# Altium schematic sheet Sheet2.SchDoc
size A2
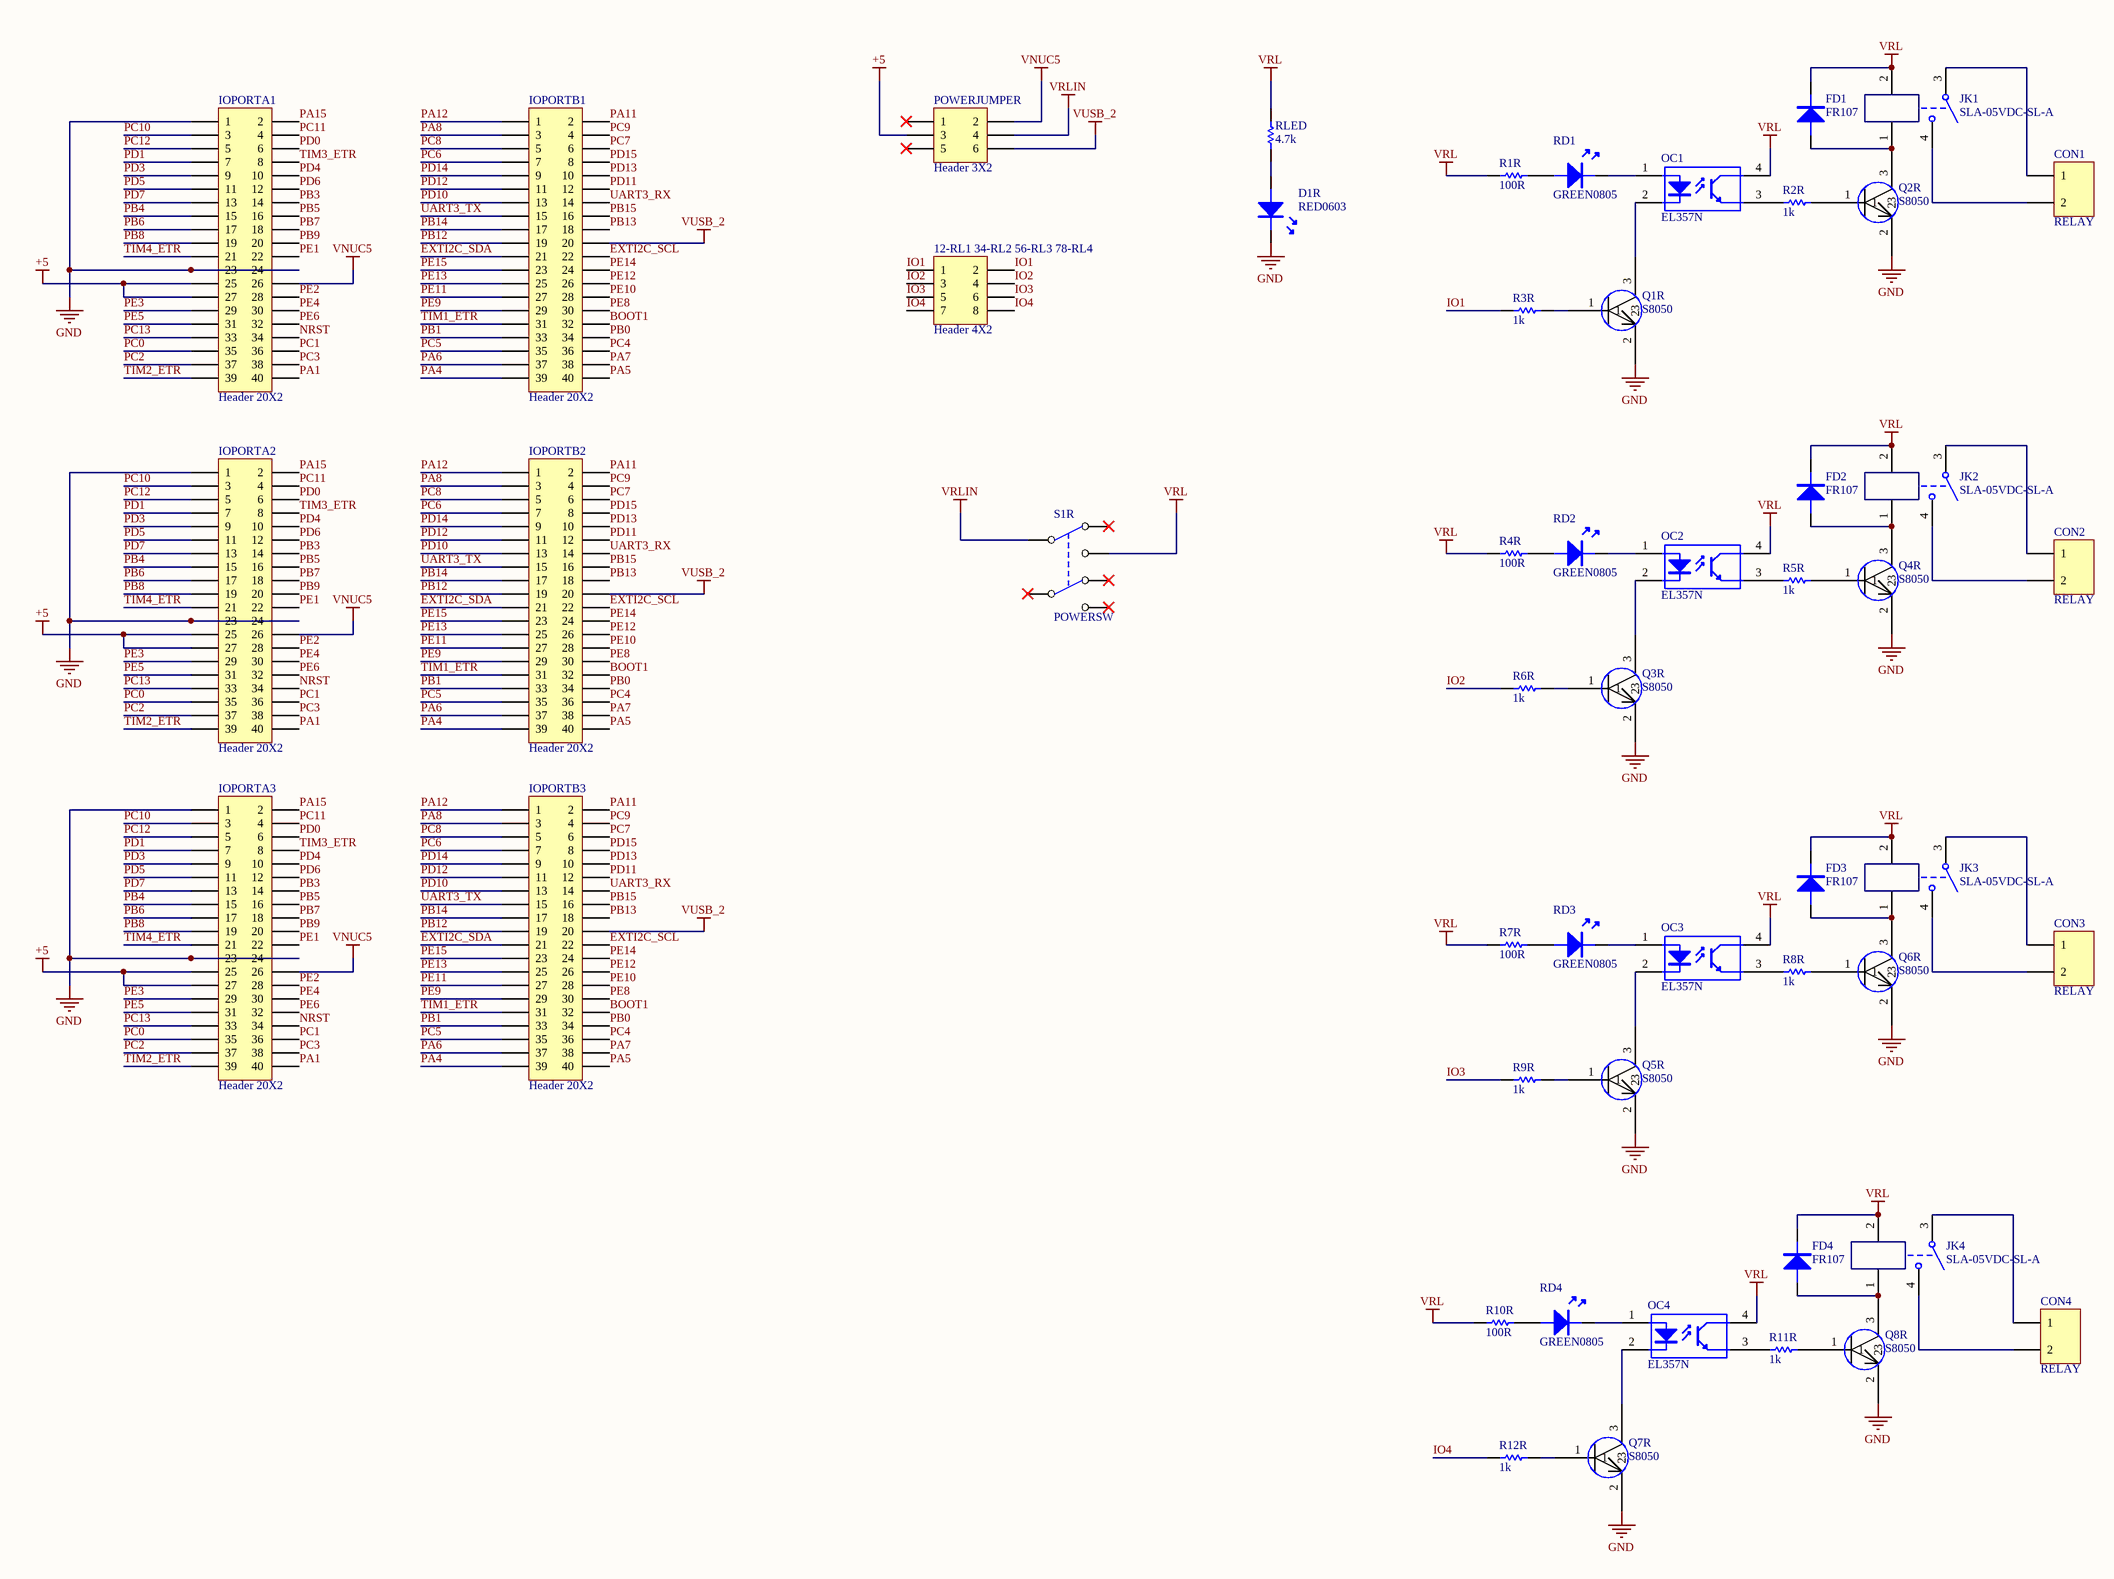
[diagram p0: Sheet2.SchDoc]

## Parts
12-RL1_34-RL2_56-RL3_78-RL4  Header 4X2  [HDR2X4]
CON1  RELAY  [KF301-2P]
CON2  RELAY  [KF301-2P]
CON3  RELAY  [KF301-2P]
CON4  RELAY  [KF301-2P]
D1R  RED0603  [LED-0603W]
FD1  FR107  [SOD-123]
FD2  FR107  [SOD-123]
FD3  FR107  [SOD-123]
FD4  FR107  [SOD-123]
IOPORTA1  Header 20X2  [HDR2X20]
IOPORTA2  Header 20X2  [HDR2X20]
IOPORTA3  Header 20X2  [HDR2X20]
IOPORTB1  Header 20X2  [HDR2X20]
IOPORTB2  Header 20X2  [HDR2X20]
IOPORTB3  Header 20X2  [HDR2X20]
JK1  SLA-05VDC-SL-A  [SLA-xxVDC-SL-A]
JK2  SLA-05VDC-SL-A  [SLA-xxVDC-SL-A]
JK3  SLA-05VDC-SL-A  [SLA-xxVDC-SL-A]
JK4  SLA-05VDC-SL-A  [SLA-xxVDC-SL-A]
OC1  EL357N  [SMD_EL357N]
OC2  EL357N  [SMD_EL357N]
OC3  EL357N  [SMD_EL357N]
OC4  EL357N  [SMD_EL357N]
POWERJUMPER  Header 3X2  [HDR2X3]
Q1R  S8050  [SOT23]
Q2R  S8050  [SOT23]
Q3R  S8050  [SOT23]
Q4R  S8050  [SOT23]
Q5R  S8050  [SOT23]
Q6R  S8050  [SOT23]
Q7R  S8050  [SOT23]
Q8R  S8050  [SOT23]
R1R  100R  [0603R]
R2R  1k  [0603R]
R3R  1k  [0603R]
R4R  100R  [0603R]
R5R  1k  [0603R]
R6R  1k  [0603R]
R7R  100R  [0603R]
R8R  1k  [0603R]
R9R  1k  [0603R]
R10R  100R  [0603R]
R11R  1k  [0603R]
R12R  1k  [0603R]
RD1  GREEN0805  [LED-0805G]
RD2  GREEN0805  [LED-0805G]
RD3  GREEN0805  [LED-0805G]
RD4  GREEN0805  [LED-0805G]
RLED  4.7k  [0603R]
S1R  POWERSW  [KFT DIP-7X7]

## Nets
+5: IOPORTA1.25 IOPORTA1.27 IOPORTA2.25 IOPORTA2.27 IOPORTA3.25 IOPORTA3.27 POWERJUMPER.3
GND: D1R.K IOPORTA1.1 IOPORTA1.23 IOPORTA1.24 IOPORTA2.1 IOPORTA2.23 IOPORTA2.24 IOPORTA3.1 IOPORTA3.23 IOPORTA3.24 Q1R.2 Q2R.2 Q3R.2 Q4R.2 Q5R.2 Q6R.2 Q7R.2 Q8R.2
VNUC5: IOPORTA1.26 IOPORTA2.26 IOPORTA3.26 POWERJUMPER.2
VRL: FD1.K FD2.K FD3.K FD4.K JK1.2 JK2.2 JK3.2 JK4.2 OC1.4(C) OC2.4(C) OC3.4(C) OC4.4(C) R1R.1 R4R.1 R7R.1 R10R.1 RLED.2 S1R.1
VRLIN: POWERJUMPER.4 S1R.2
VUSB_2: IOPORTB1.20 IOPORTB2.20 IOPORTB3.20 POWERJUMPER.6
BOOT1: IOPORTB1.32 IOPORTB2.32 IOPORTB3.32
EXTI2C_SCL: IOPORTB1.22 IOPORTB2.22 IOPORTB3.22
EXTI2C_SDA: IOPORTB1.21 IOPORTB2.21 IOPORTB3.21
IO1: 12-RL1_34-RL2_56-RL3_78-RL4.1 12-RL1_34-RL2_56-RL3_78-RL4.2 R3R.1
IO2: 12-RL1_34-RL2_56-RL3_78-RL4.3 12-RL1_34-RL2_56-RL3_78-RL4.4 R6R.1
IO3: 12-RL1_34-RL2_56-RL3_78-RL4.5 12-RL1_34-RL2_56-RL3_78-RL4.6 R9R.1
IO4: 12-RL1_34-RL2_56-RL3_78-RL4.7 12-RL1_34-RL2_56-RL3_78-RL4.8 R12R.1
NRST: IOPORTA1.34 IOPORTA2.34 IOPORTA3.34
PA1: IOPORTA1.40 IOPORTA2.40 IOPORTA3.40
PA4: IOPORTB1.39 IOPORTB2.39 IOPORTB3.39
PA5: IOPORTB1.40 IOPORTB2.40 IOPORTB3.40
PA6: IOPORTB1.37 IOPORTB2.37 IOPORTB3.37
PA7: IOPORTB1.38 IOPORTB2.38 IOPORTB3.38
PA8: IOPORTB1.3 IOPORTB2.3 IOPORTB3.3
PA11: IOPORTB1.2 IOPORTB2.2 IOPORTB3.2
PA12: IOPORTB1.1 IOPORTB2.1 IOPORTB3.1
PA15: IOPORTA1.2 IOPORTA2.2 IOPORTA3.2
PB0: IOPORTB1.34 IOPORTB2.34 IOPORTB3.34
PB1: IOPORTB1.33 IOPORTB2.33 IOPORTB3.33
PB3: IOPORTA1.14 IOPORTA2.14 IOPORTA3.14
PB4: IOPORTA1.15 IOPORTA2.15 IOPORTA3.15
PB5: IOPORTA1.16 IOPORTA2.16 IOPORTA3.16
PB6: IOPORTA1.17 IOPORTA2.17 IOPORTA3.17
PB7: IOPORTA1.18 IOPORTA2.18 IOPORTA3.18
PB8: IOPORTA1.19 IOPORTA2.19 IOPORTA3.19
PB9: IOPORTA1.20 IOPORTA2.20 IOPORTA3.20
PB12: IOPORTB1.19 IOPORTB2.19 IOPORTB3.19
PB13: IOPORTB1.18 IOPORTB2.18 IOPORTB3.18
PB14: IOPORTB1.17 IOPORTB2.17 IOPORTB3.17
PB15: IOPORTB1.16 IOPORTB2.16 IOPORTB3.16
PC0: IOPORTA1.35 IOPORTA2.35 IOPORTA3.35
PC1: IOPORTA1.36 IOPORTA2.36 IOPORTA3.36
PC2: IOPORTA1.37 IOPORTA2.37 IOPORTA3.37
PC3: IOPORTA1.38 IOPORTA2.38 IOPORTA3.38
PC4: IOPORTB1.36 IOPORTB2.36 IOPORTB3.36
PC5: IOPORTB1.35 IOPORTB2.35 IOPORTB3.35
PC6: IOPORTB1.7 IOPORTB2.7 IOPORTB3.7
PC7: IOPORTB1.6 IOPORTB2.6 IOPORTB3.6
PC8: IOPORTB1.5 IOPORTB2.5 IOPORTB3.5
PC9: IOPORTB1.4 IOPORTB2.4 IOPORTB3.4
PC10: IOPORTA1.3 IOPORTA2.3 IOPORTA3.3
PC11: IOPORTA1.4 IOPORTA2.4 IOPORTA3.4
PC12: IOPORTA1.5 IOPORTA2.5 IOPORTA3.5
PC13: IOPORTA1.33 IOPORTA2.33 IOPORTA3.33
PD0: IOPORTA1.6 IOPORTA2.6 IOPORTA3.6
PD1: IOPORTA1.7 IOPORTA2.7 IOPORTA3.7
PD3: IOPORTA1.9 IOPORTA2.9 IOPORTA3.9
PD4: IOPORTA1.10 IOPORTA2.10 IOPORTA3.10
PD5: IOPORTA1.11 IOPORTA2.11 IOPORTA3.11
PD6: IOPORTA1.12 IOPORTA2.12 IOPORTA3.12
PD7: IOPORTA1.13 IOPORTA2.13 IOPORTA3.13
PD10: IOPORTB1.13 IOPORTB2.13 IOPORTB3.13
PD11: IOPORTB1.12 IOPORTB2.12 IOPORTB3.12
PD12: IOPORTB1.11 IOPORTB2.11 IOPORTB3.11
PD13: IOPORTB1.10 IOPORTB2.10 IOPORTB3.10
PD14: IOPORTB1.9 IOPORTB2.9 IOPORTB3.9
PD15: IOPORTB1.8 IOPORTB2.8 IOPORTB3.8
PE1: IOPORTA1.22 IOPORTA2.22 IOPORTA3.22
PE2: IOPORTA1.28 IOPORTA2.28 IOPORTA3.28
PE3: IOPORTA1.29 IOPORTA2.29 IOPORTA3.29
PE4: IOPORTA1.30 IOPORTA2.30 IOPORTA3.30
PE5: IOPORTA1.31 IOPORTA2.31 IOPORTA3.31
PE6: IOPORTA1.32 IOPORTA2.32 IOPORTA3.32
PE8: IOPORTB1.30 IOPORTB2.30 IOPORTB3.30
PE9: IOPORTB1.29 IOPORTB2.29 IOPORTB3.29
PE10: IOPORTB1.28 IOPORTB2.28 IOPORTB3.28
PE11: IOPORTB1.27 IOPORTB2.27 IOPORTB3.27
PE12: IOPORTB1.26 IOPORTB2.26 IOPORTB3.26
PE13: IOPORTB1.25 IOPORTB2.25 IOPORTB3.25
PE14: IOPORTB1.24 IOPORTB2.24 IOPORTB3.24
PE15: IOPORTB1.23 IOPORTB2.23 IOPORTB3.23
TIM1_ETR: IOPORTB1.31 IOPORTB2.31 IOPORTB3.31
TIM2_ETR: IOPORTA1.39 IOPORTA2.39 IOPORTA3.39
TIM3_ETR: IOPORTA1.8 IOPORTA2.8 IOPORTA3.8
TIM4_ETR: IOPORTA1.21 IOPORTA2.21 IOPORTA3.21
UART3_RX: IOPORTB1.14 IOPORTB2.14 IOPORTB3.14
UART3_TX: IOPORTB1.15 IOPORTB2.15 IOPORTB3.15
NetCON1_1: CON1.1 JK1.3
NetCON1_2: CON1.2 JK1.4
NetCON2_1: CON2.1 JK2.3
NetCON2_2: CON2.2 JK2.4
NetCON3_1: CON3.1 JK3.3
NetCON3_2: CON3.2 JK3.4
NetCON4_1: CON4.1 JK4.3
NetCON4_2: CON4.2 JK4.4
NetD1R_A: D1R.A RLED.1
NetFD1_A: FD1.A JK1.1 Q2R.3
NetFD2_A: FD2.A JK2.1 Q4R.3
NetFD3_A: FD3.A JK3.1 Q6R.3
NetFD4_A: FD4.A JK4.1 Q8R.3
NetOC1_1: OC1.1(A) RD1.K
NetOC1_2: OC1.2(K) Q1R.3
NetOC1_3: OC1.3(E) R2R.1
NetOC2_1: OC2.1(A) RD2.K
NetOC2_2: OC2.2(K) Q3R.3
NetOC2_3: OC2.3(E) R5R.1
NetOC3_1: OC3.1(A) RD3.K
NetOC3_2: OC3.2(K) Q5R.3
NetOC3_3: OC3.3(E) R8R.1
NetOC4_1: OC4.1(A) RD4.K
NetOC4_2: OC4.2(K) Q7R.3
NetOC4_3: OC4.3(E) R11R.1
NetQ1R_1: Q1R.1 R3R.2
NetQ2R_1: Q2R.1 R2R.2
NetQ3R_1: Q3R.1 R6R.2
NetQ4R_1: Q4R.1 R5R.2
NetQ5R_1: Q5R.1 R9R.2
NetQ6R_1: Q6R.1 R8R.2
NetQ7R_1: Q7R.1 R12R.2
NetQ8R_1: Q8R.1 R11R.2
NetR1R_2: R1R.2 RD1.A
NetR4R_2: R4R.2 RD2.A
NetR7R_2: R7R.2 RD3.A
NetR10R_2: R10R.2 RD4.A

Not connected (* = marked no-connect by the designer): POWERJUMPER 1* 5*; S1R 3* 4* 5* 6*

## Library data of the parts
12-RL1_34-RL2_56-RL3_78-RL4 = Header 4X2: Header, 4-Pin, Dual row; LatestRevisionDate: 17-Jul-2002; LatestRevisionNote: Re-released for DXP Platform.; Publisher: Altium Limited
CON1-CON4 = Connector-2P
D1R RD1-RD4 = LED
FD1-FD4 = DIODE: 普通二极管
IOPORTA1-IOPORTA3 IOPORTB1-IOPORTB3 = Header 20X2: Header, 20-Pin, Dual row; LatestRevisionDate: 17-Jul-2002; LatestRevisionNote: Re-released for DXP Platform.; Publisher: Altium Limited
JK1-JK4 = SLA-05VDC-SL-A: 5V常开
OC1-OC4 = EL357N: 线性光耦
POWERJUMPER = Header 3X2: Header, 3-Pin, Dual row; LatestRevisionDate: 17-Jul-2002; LatestRevisionNote: Re-released for DXP Platform.; Publisher: Altium Limited
Q1R Q2R Q3R Q4R Q5R Q6R Q7R Q8R = S9014
R1R R2R R3R R4R R5R R6R R7R R8R R9R R10R R11R R12R RLED = RES
S1R = KFT DIP-7X7